# Altium schematic sheet Connectors.SchDoc
size A; SheetNumber: 8; SheetTotal: 10
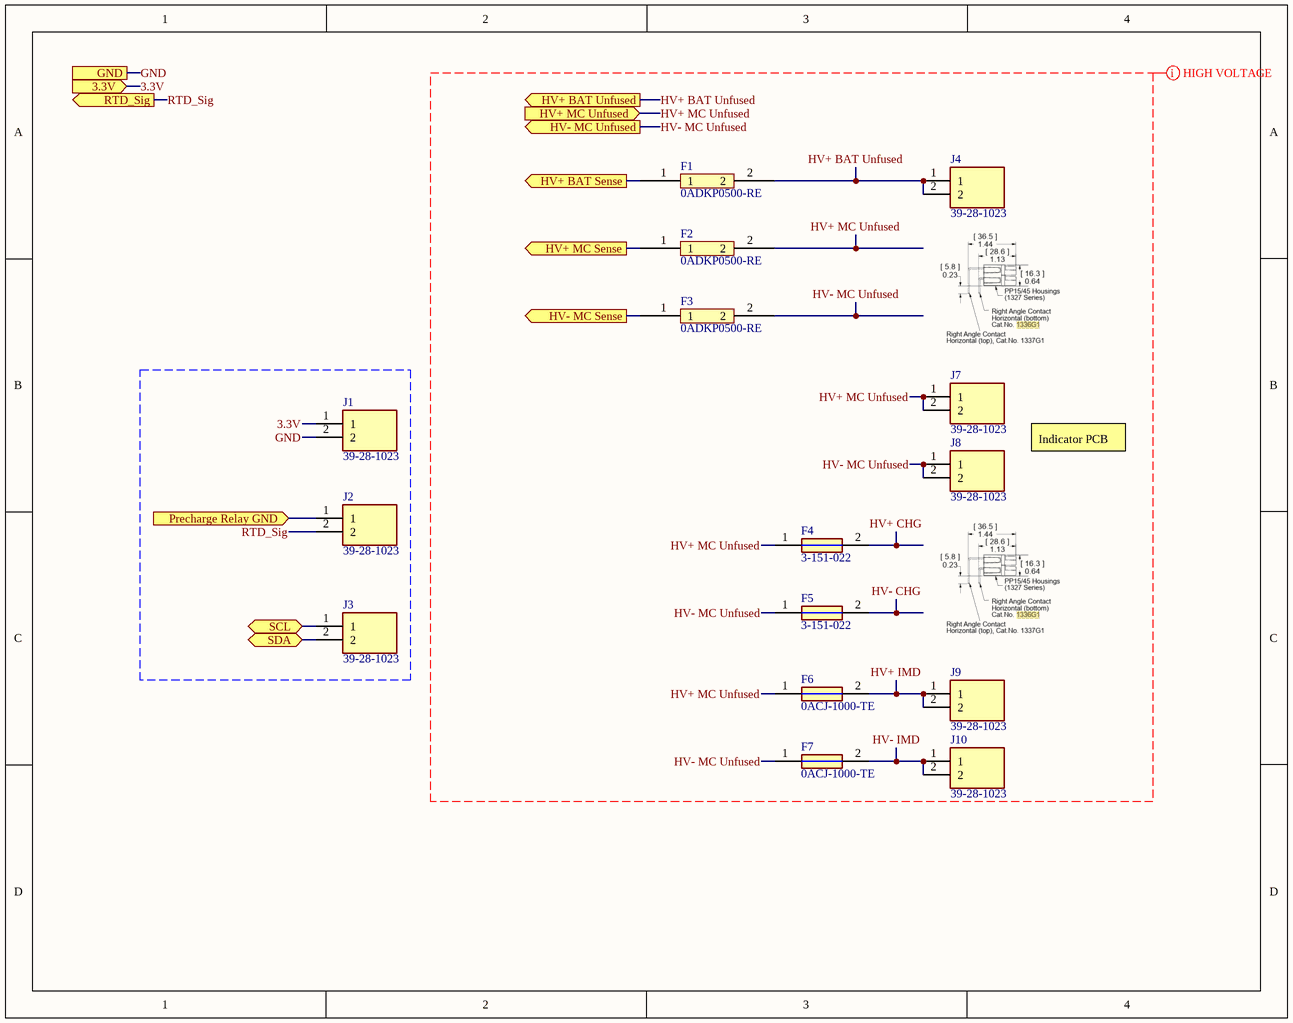
[diagram p0: Connectors.SchDoc]

## Parts
F1  0ADKP0500-RE  [0ADKP0500-RE]
F2  0ADKP0500-RE  [0ADKP0500-RE]
F3  0ADKP0500-RE  [0ADKP0500-RE]
F4  3-151-022  [3151022]
F5  3-151-022  [3151022]
F6  0ACJ-1000-TE  [FUSC13250X555N]
F7  0ACJ-1000-TE  [FUSC13250X555N]
J1  39-28-1023  [39-28-1023]
J2  39-28-1023  [39-28-1023]
J3  39-28-1023  [39-28-1023]
J4  39-28-1023  [39-28-1023]
J7  39-28-1023  [39-28-1023]
J8  39-28-1023  [39-28-1023]
J9  39-28-1023  [39-28-1023]
J10  39-28-1023  [39-28-1023]

## Ports
3.3V (in), GND, HV+ BAT Sense (out), HV+ BAT Unfused (out), HV+ MC Sense (out), HV+ MC Unfused (in), HV- MC Sense (out), HV- MC Unfused (out), Precharge Relay GND (in), RTD_Sig (out), SCL (bidir), SDA (bidir)

## Nets
3.3V: J1.1 ; port 3.3V
GND: J1.2 ; port GND
HV+ BAT Sense: F1.1 ; port HV+ BAT Sense
HV+ BAT Unfused: F1.2 J4.1 J4.2 ; port HV+ BAT Unfused
HV+ CHG: F4.2
HV+ IMD: F6.2 J9.1 J9.2
HV+ MC Sense: F2.1 ; port HV+ MC Sense
HV+ MC Unfused: F2.2 F4.1 F6.1 J7.1 J7.2 ; port HV+ MC Unfused
HV- CHG: F5.2
HV- IMD: F7.2 J10.1 J10.2
HV- MC Sense: F3.1 ; port HV- MC Sense
HV- MC Unfused: F3.2 F5.1 F7.1 J8.1 J8.2 ; port HV- MC Unfused
Precharge Relay GND: J2.1 ; port Precharge Relay GND
RTD_Sig: J2.2 ; port RTD_Sig
SCL: J3.1 ; port SCL
SDA: J3.2 ; port SDA

## Layout directives
mark named HIGH VOLTAGE: HV+ BAT Unfused, HV+ CHG, HV+ IMD, HV+ MC Unfused, HV- CHG, HV- IMD, HV- MC Unfused

## Notes on the sheet
- Indicator PCB

## Library data of the parts
F1-F3 = 0ADKP0500-RE: Fuse
F4 F5 = 3-151-022: Fuse; Manufacturer_Name: SCHURTER; Datasheet Link: https://www.schurter.com/en/datasheet/AMO_10.3x38; Manufacturer_Part_Number: 3-151-022
F6 F7 = 0ACJ-1000-TE: Fuse; Manufacturer_Name: BelFuse; Datasheet Link: https://www.mouser.de/datasheet/2/643/ds_CP_0ACJ_series-3045709.pdf; Height: 5.55mm; Manufacturer_Part_Number: 0ACJ-1000-TE; Mouser Part Number: 530-0ACJ-1000-TE; Mouser Price/Stock: https://www.mouser.co.uk/ProductDetail/Bel-Fuse/0ACJ-1000-TE?qs=T%252BzbugeAwjiHfega9XRYqg%3D%3D; Arrow Part Number: 0ACJ-1000-TE; Arrow Price/Stock: https://www.arrow.com/en/products/0acj-1000-te/bel-group?utm_currency=USD&region=nac
J1-J4 J7-J10 = 39-28-1023: Connector; Manufacturer_Name: Molex; Datasheet Link: https://www.molex.com/pdm_docs/sd/039281023_sd.pdf; Height: 12.8mm; Manufacturer_Part_Number: 39-28-1023; Mouser Part Number: 538-39-28-1023; Mouser Price/Stock: https://www.mouser.co.uk/ProductDetail/Molex/39-28-1023?qs=LQQHZ4xw2XBykFU0jRHvlQ%3D%3D; Arrow Part Number: 39-28-1023; Arrow Price/Stock: https://www.arrow.com/en/products/39-28-1023/molex?region=nac